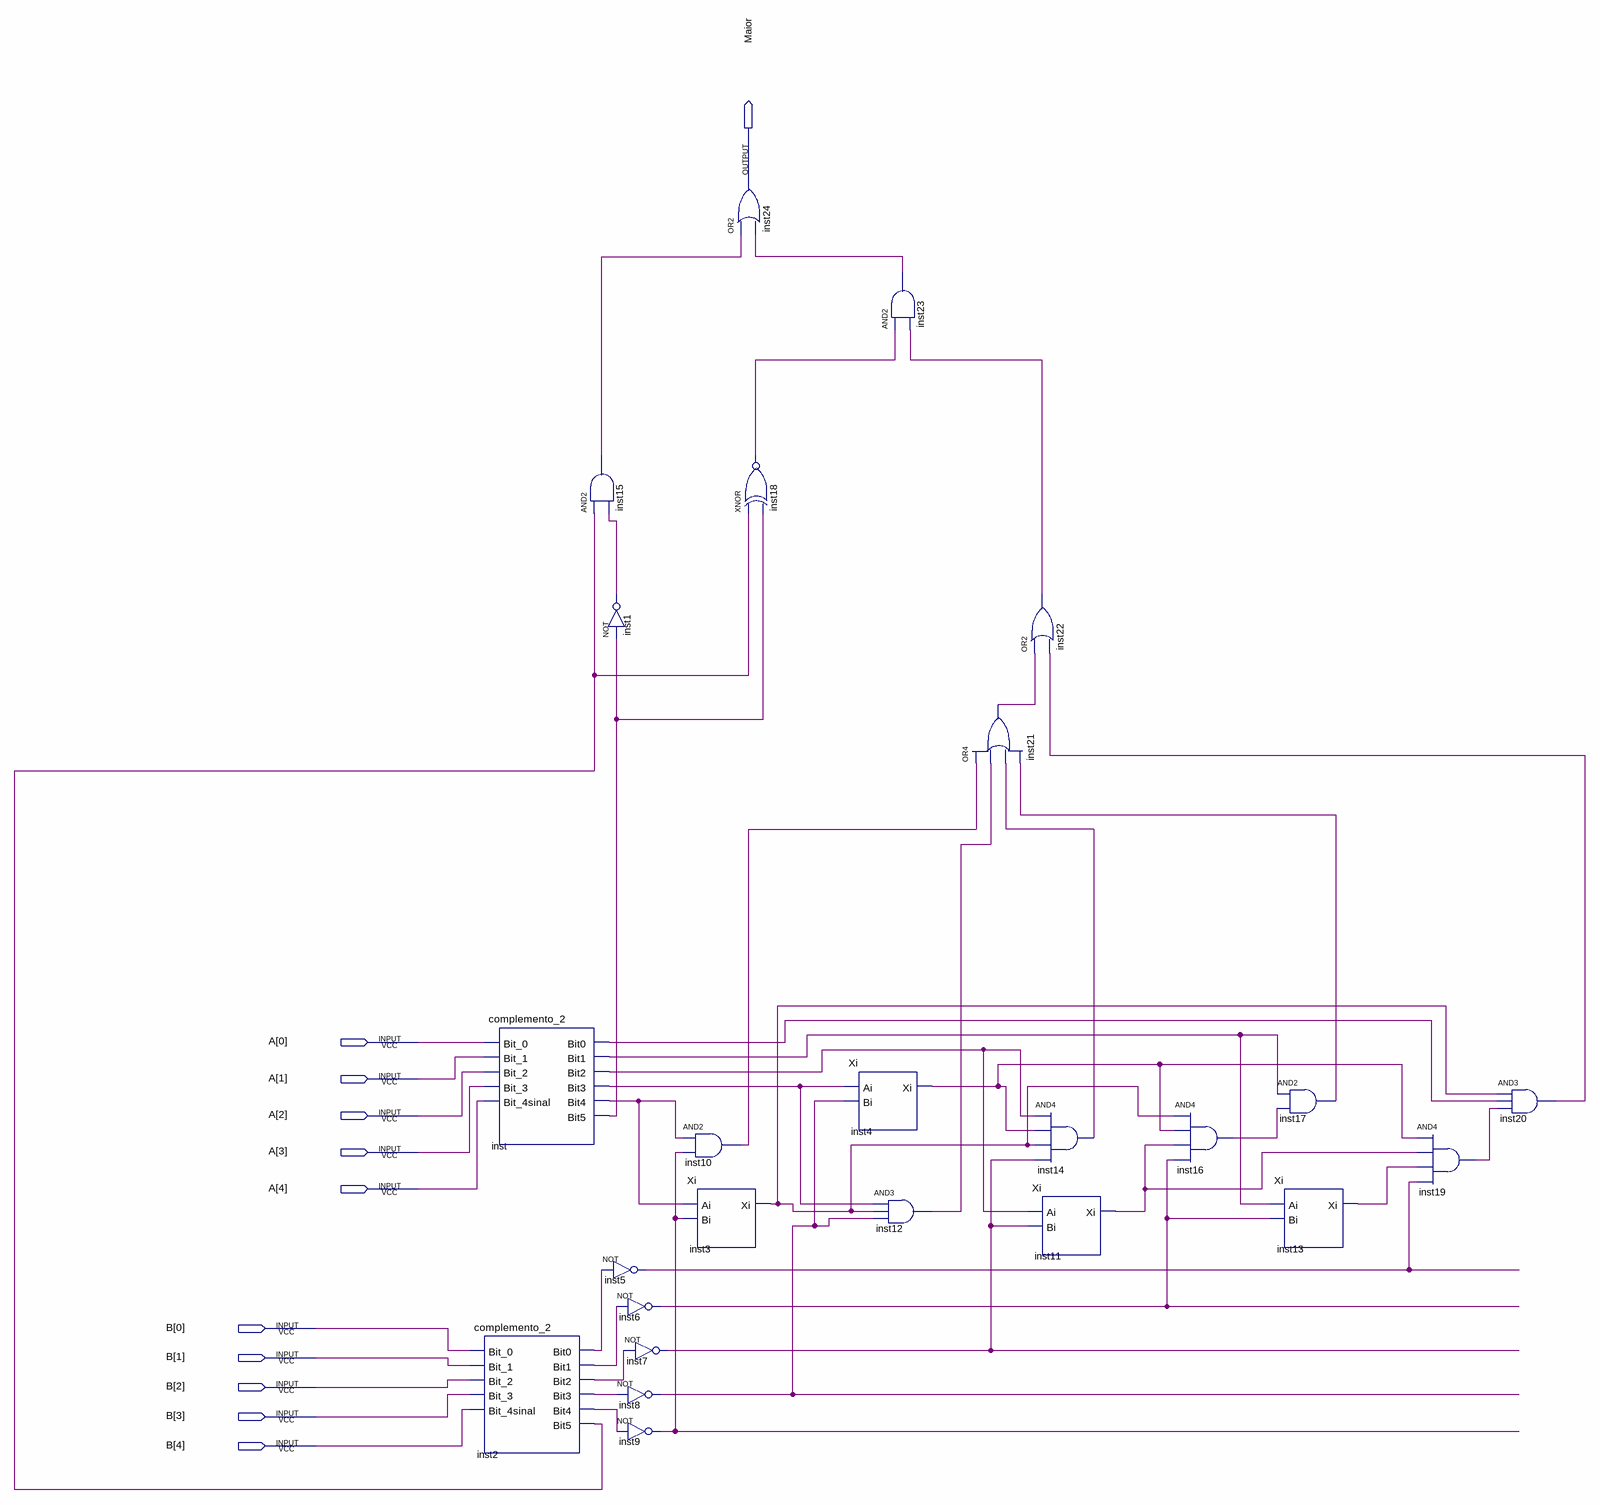
[diagram p0: schematic sheet]
// Quartus schematic comparador_maior.bdf as structural Verilog: 25 symbols, 11 pins
module comparador_maior (
  input  [4:0] A,
  input  [4:0] B,
  output Maior
);

  wire inst1_out, inst2_bit0, inst2_bit1, inst2_bit2, inst2_bit3, inst2_bit4, inst2_bit5, inst3_xi, inst4_xi,
       inst5_out, inst6_out, inst7_out, inst8_out, inst9_out, inst10_out, inst11_xi, inst12_out, inst13_xi,
       inst14_out, inst15_out, inst16_out, inst17_out, inst18_out, inst19_out, inst20_out, inst21_out,
       inst22_out, inst23_out, inst_bit0, inst_bit1, inst_bit2, inst_bit3, inst_bit4, inst_bit5;

  complemento_2 inst2 (
    .Bit_0(B[0]), .Bit_1(B[1]), .Bit_2(B[2]), .Bit_3(B[3]), .Bit_4sinal(B[4]), .Bit0(inst2_bit0),
    .Bit1(inst2_bit1), .Bit2(inst2_bit2), .Bit3(inst2_bit3), .Bit4(inst2_bit4), .Bit5(inst2_bit5));
  complemento_2 inst (
    .Bit_0(A[0]), .Bit_1(A[1]), .Bit_2(A[2]), .Bit_3(A[3]), .Bit_4sinal(A[4]), .Bit0(inst_bit0),
    .Bit1(inst_bit1), .Bit2(inst_bit2), .Bit3(inst_bit3), .Bit4(inst_bit4), .Bit5(inst_bit5));
  and inst15 (inst15_out, inst2_bit5, inst1_out);
  not inst1 (inst1_out, inst_bit5);
  not inst5 (inst5_out, inst2_bit0);
  not inst6 (inst6_out, inst2_bit1);
  not inst7 (inst7_out, inst2_bit2);
  not inst8 (inst8_out, inst2_bit3);
  not inst9 (inst9_out, inst2_bit4);
  and inst10 (inst10_out, inst_bit4, inst9_out);
  Xi inst3 (.Ai(inst_bit4), .Bi(inst9_out), .Xi(inst3_xi));
  or inst24 (Maior, inst15_out, inst23_out);
  xnor inst18 (inst18_out, inst2_bit5, inst_bit5);
  and inst23 (inst23_out, inst18_out, inst22_out);
  Xi inst4 (.Ai(inst_bit3), .Bi(inst8_out), .Xi(inst4_xi));
  and inst12 (inst12_out, inst_bit3, inst3_xi, inst8_out);
  or inst21 (inst21_out, inst10_out, inst12_out, inst14_out, inst17_out);
  or inst22 (inst22_out, inst21_out, inst20_out);
  and inst14 (inst14_out, inst_bit2, inst4_xi, inst3_xi, inst7_out);
  Xi inst11 (.Ai(inst_bit2), .Bi(inst7_out), .Xi(inst11_xi));
  and inst16 (inst16_out, inst3_xi, inst4_xi, inst11_xi, inst6_out);
  and inst17 (inst17_out, inst_bit1, inst16_out);
  Xi inst13 (.Ai(inst_bit1), .Bi(inst6_out), .Xi(inst13_xi));
  and inst19 (inst19_out, inst4_xi, inst11_xi, inst13_xi, inst5_out);
  and inst20 (inst20_out, inst3_xi, inst_bit0, inst19_out);
endmodule
